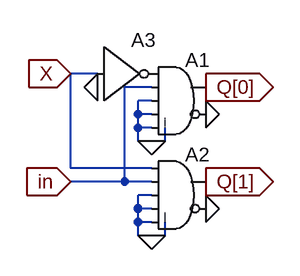
[diagram p0: schematic demux-1bit-1to2.asc]
demux-1bit-1to2.asc, the LTspice schematic file:
Version 4
SHEET 1 880 680
WIRE -32 48 -64 48
WIRE 32 64 0 64
WIRE 32 80 16 80
WIRE 16 96 16 80
WIRE 32 96 16 96
WIRE 16 112 16 96
WIRE 32 112 16 112
WIRE 16 128 16 112
WIRE 32 128 16 128
WIRE 48 128 48 112
WIRE 48 128 32 128
WIRE -64 160 -64 48
WIRE 32 160 -64 160
WIRE 0 176 0 64
WIRE 0 176 -64 176
WIRE 32 176 0 176
WIRE 32 192 16 192
WIRE 16 208 16 192
WIRE 32 208 16 208
WIRE 16 224 16 208
WIRE 32 224 16 224
WIRE 16 240 16 224
WIRE 32 240 16 240
WIRE 48 240 48 224
WIRE 48 240 32 240
FLAG 32 128 0
FLAG 32 240 0
FLAG 96 96 0
FLAG 96 208 0
FLAG -64 176 in
IOPIN -64 176 In
FLAG 96 64 Q[0]
IOPIN 96 64 Out
FLAG 96 176 Q[1]
IOPIN 96 176 Out
FLAG -32 64 0
FLAG -64 48 X
IOPIN -64 48 In
SYMBOL Digital\\and 64 16 R0
SYMATTR InstName A1
SYMBOL Digital\\and 64 128 R0
SYMATTR InstName A2
SYMBOL Digital\\inv -32 -16 R0
SYMATTR InstName A3

The netlist it stands for:
* demux-1bit-1to2.asc
A1 P001 in 0 0 0 0 Q[0] 0 AND
A2 X in 0 0 0 0 Q[1] 0 AND
A3 X 0 0 0 0 P001 0 0 BUF
.backanno
.end